# Altium schematic sheet DM3370_Connector_B.SchDoc: =project_title
size Tabloid; CompanyName: Luxonis Holding; Organization: Luxonis Holding; Address1: 1925 Harmony Park Drive; Address2: Westminster, CO; Address3: 80234; Address4: United States; DocumentNumber: 5; SheetNumber: 5; SheetTotal: 17
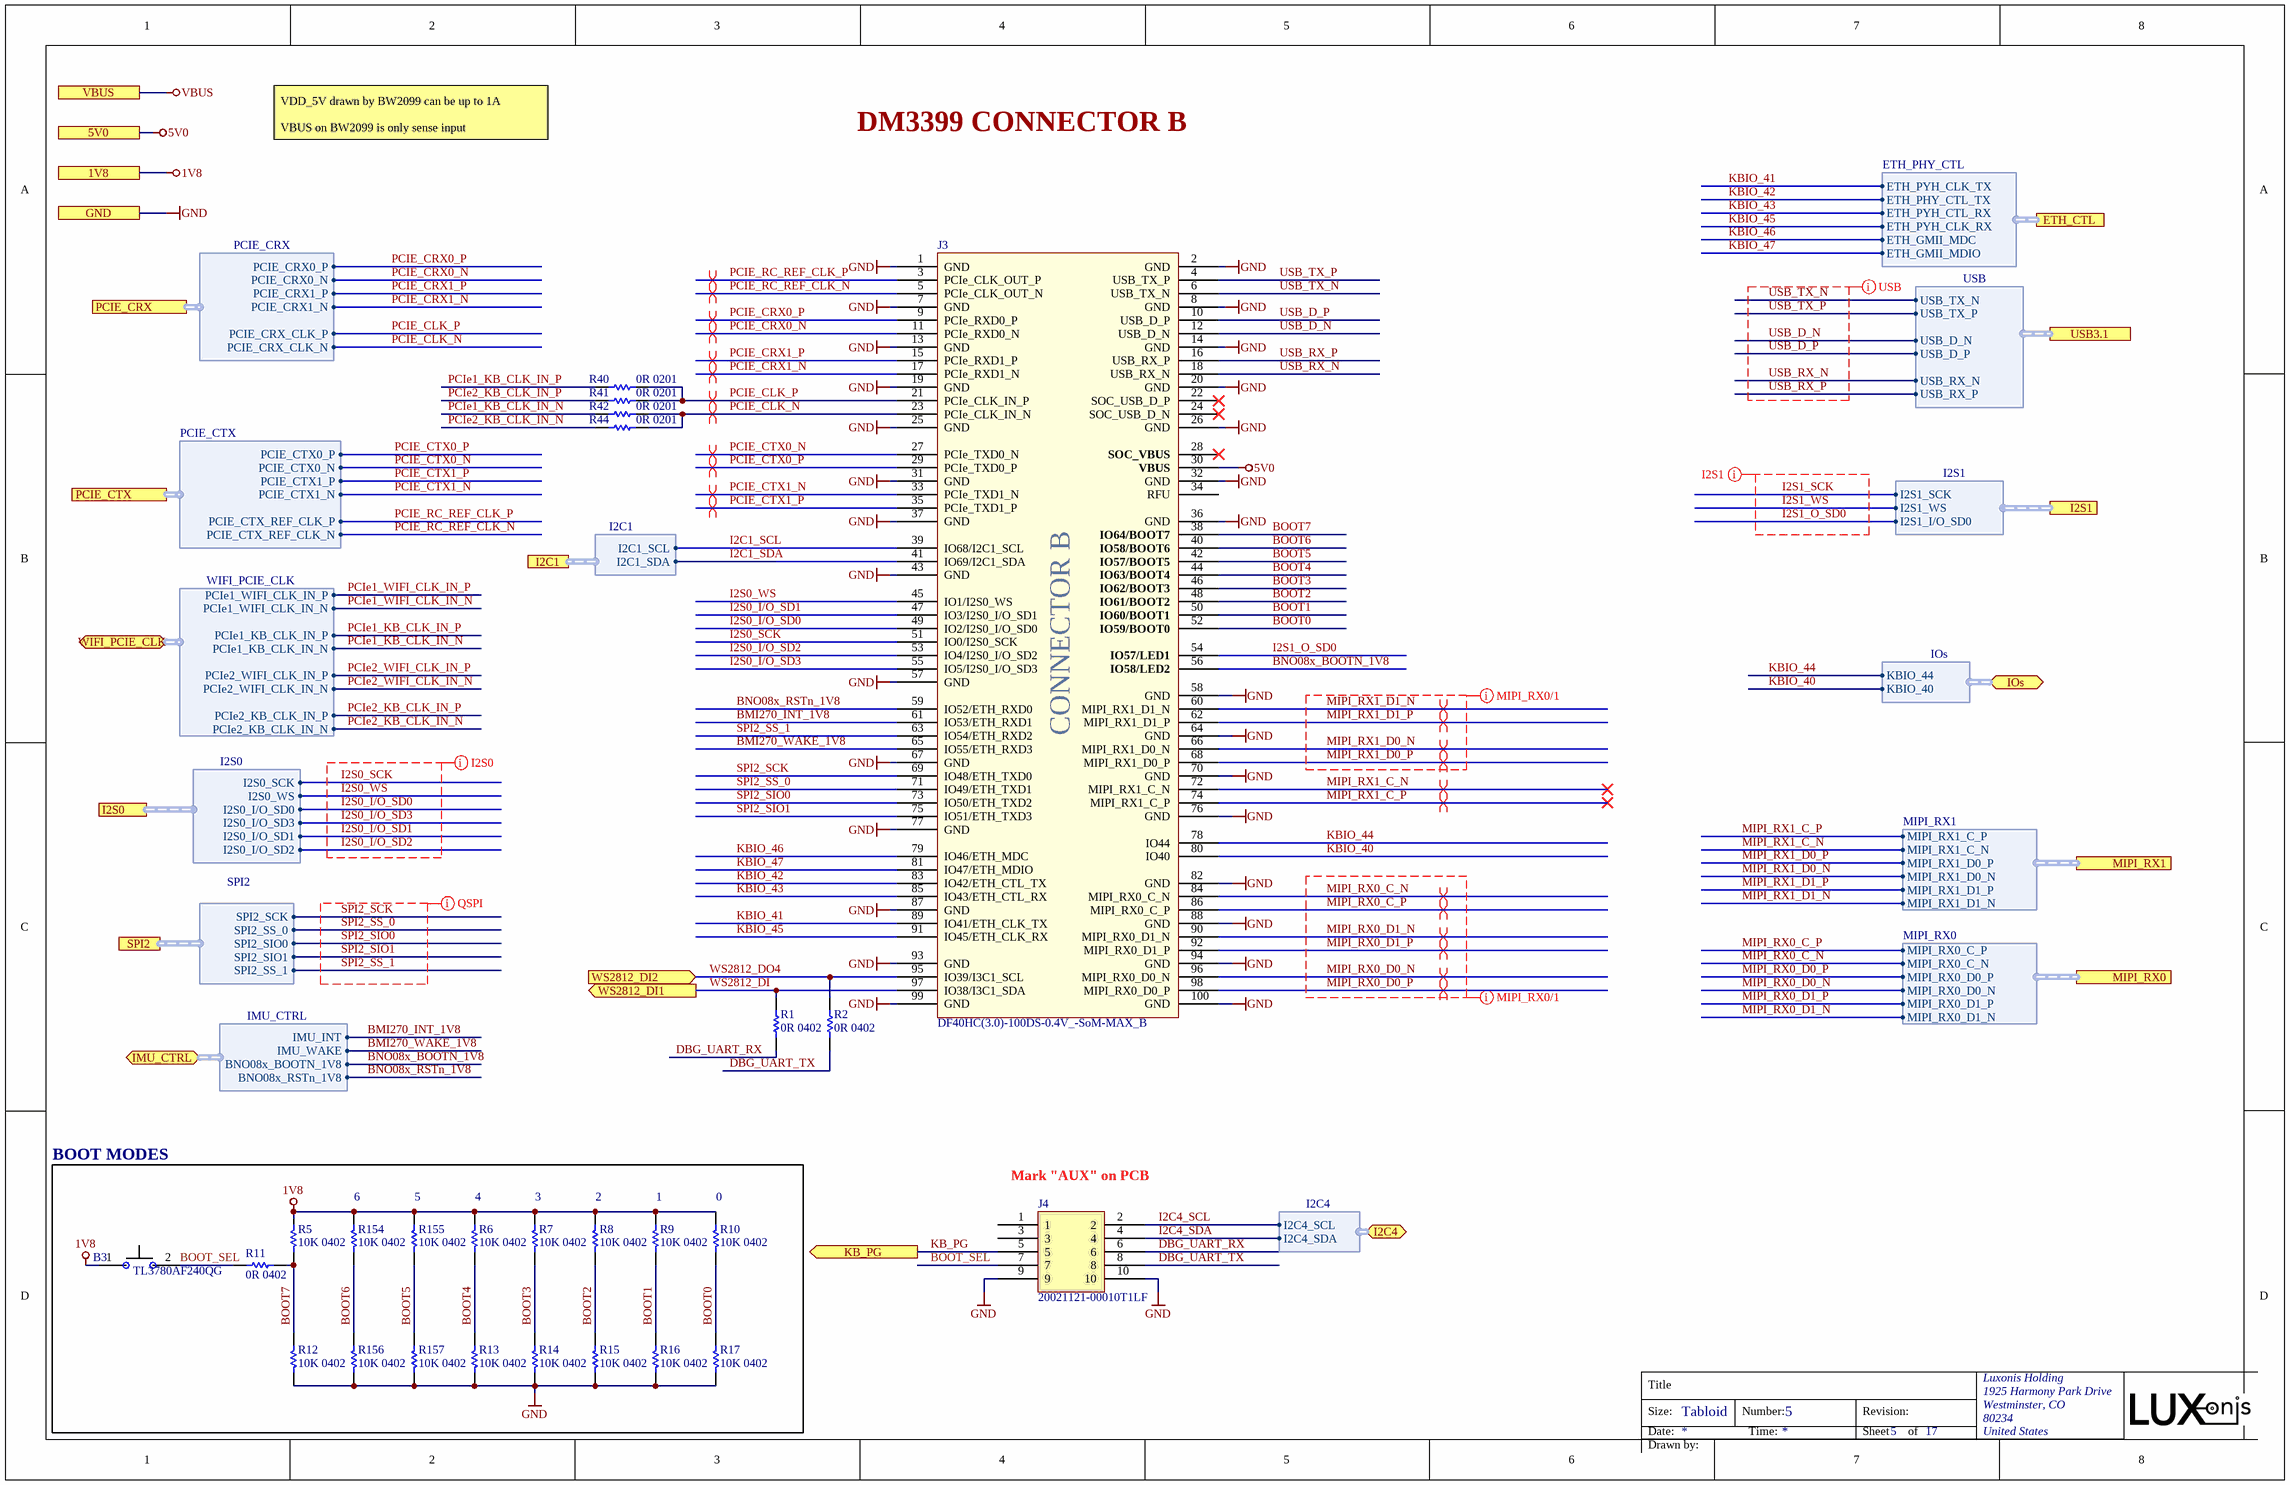
[diagram p0: DM3370_Connector_B.SchDoc]

## Parts
B3  TL3780AF240QG  [TL3780AF240QG-Footprint-1]
J3  DF40HC(3.0)-100DS-0.4V_-SoM-MAX_B  [SOM_MAX_CONN_B_DF40HC-3.0-100DS-0.4V_minpad]
J4  20021121-00010T1LF  [20021121-00010T1LF]
R1  0R 0402  [RESC0402(1005)_L]
R2  0R 0402  [RESC0402(1005)_L]
R5  10K 0402  [RESC0402(1005)_L]
R6  10K 0402  [RESC0402(1005)_L]
R7  10K 0402  [RESC0402(1005)_L]
R8  10K 0402  [RESC0402(1005)_L]
R9  10K 0402  [RESC0402(1005)_L]
R10  10K 0402  [RESC0402(1005)_L]
R11  0R 0402  [RESC0402(1005)_L]
R12  10K 0402  [RESC0402(1005)_L]
R13  10K 0402  [RESC0402(1005)_L]
R14  10K 0402  [RESC0402(1005)_L]
R15  10K 0402  [RESC0402(1005)_L]
R16  10K 0402  [RESC0402(1005)_L]
R17  10K 0402  [RESC0402(1005)_L]
R40  0R 0201  [RESC0201(0603)_L]
R41  0R 0201  [RESC0201(0603)_L]
R42  0R 0201  [RESC0201(0603)_L]
R44  0R 0201  [RESC0201(0603)_L]
R154  10K 0402  [RESC0402(1005)_L]
R155  10K 0402  [RESC0402(1005)_L]
R156  10K 0402  [RESC0402(1005)_L]
R157  10K 0402  [RESC0402(1005)_L]

## Blocks framed on the sheet
BOOT MODES: B3 R5-R17 R154-R157

## Ports
1V8, 5V0, ETH_CTL (harness ETH_PHY_CTL), GND, I2C1 (harness I2C1), I2C4 (bidir, harness I2C4), I2S0 (harness I2S0), I2S1 (harness I2S1), IMU_CTRL (bidir, harness IMU_CTRL), IOs (bidir, harness IOs), KB_PG (out), MIPI_RX0 (harness MIPI_RX0), MIPI_RX1 (harness MIPI_RX1), PCIE_CRX (harness PCIE_CRX), PCIE_CTX (harness PCIE_CTX), SPI2 (harness SPI2), USB3.1 (harness USB), VBUS, WIFI_PCIE_CLK (bidir, harness WIFI_PCIE_CLK), WS2812_DI1 (out), WS2812_DI2 (in)

## Harnesses
I2C4: I2C4_SCL, I2C4_SDA
I2S0: I2S0_SCK, I2S0_WS, I2S0_I/O_SD0, I2S0_I/O_SD1, I2S0_I/O_SD2, I2S0_I/O_SD3
USB: USB_D_P, USB_D_N, USB_TX_N, USB_TX_P, USB_RX_N, USB_RX_P
PCIE_CRX: PCIE_CRX0_P, PCIE_CRX0_N, PCIE_CRX1_P, PCIE_CRX1_N, PCIE_CRX_CLK_P, PCIE_CRX_CLK_N
PCIE_CTX: PCIE_CTX0_P, PCIE_CTX0_N, PCIE_CTX1_P, PCIE_CTX1_N, PCIE_CTX_REF_CLK_P, PCIE_CTX_REF_CLK_N
ETH_PHY_CTL: ETH_PYH_CLK_TX, ETH_PHY_CTL_TX, ETH_PYH_CTL_RX, ETH_PYH_CLK_RX, ETH_GMII_MDC, ETH_GMII_MDIO
MIPI_RX0: MIPI_RX0_C_P, MIPI_RX0_C_N, MIPI_RX0_D0_P, MIPI_RX0_D0_N, MIPI_RX0_D1_P, MIPI_RX0_D1_N
MIPI_RX1: MIPI_RX1_C_P, MIPI_RX1_C_N, MIPI_RX1_D0_P, MIPI_RX1_D0_N, MIPI_RX1_D1_P, MIPI_RX1_D1_N
I2C1: I2C1_SDA, I2C1_SCL
SPI2: SPI2_SCK, SPI2_SS_0, SPI2_SIO0, SPI2_SIO1, SPI2_SS_1
WIFI_PCIE_CLK: PCIe1_WIFI_CLK_IN_P, PCIe1_WIFI_CLK_IN_N, PCIe1_KB_CLK_IN_P, PCIe1_KB_CLK_IN_N, PCIe2_WIFI_CLK_IN_P, PCIe2_WIFI_CLK_IN_N, PCIe2_KB_CLK_IN_P, PCIe2_KB_CLK_IN_N
IOs: KBIO_44, KBIO_40
I2S1: I2S1_SCK, I2S1_WS, I2S1_I/O_SD0
IMU_CTRL: IMU_INT, IMU_WAKE, BNO08x_BOOTN_1V8, BNO08x_RSTn_1V8

## Nets
1V8: B3.1 R5.1 R6.1 R7.1 R8.1 R9.1 R10.1 R154.1 R155.1 ; port 1V8
5V0: J3.30(VBUS) ; port 5V0
GND: J3.1(GND) J3.2(GND) J3.7(GND) J3.8(GND) J3.13(GND) J3.14(GND) J3.19(GND) J3.20(GND) J3.25(GND) J3.26(GND) J3.31(GND) J3.32(GND) J3.36(GND) J3.37(GND) J3.43(GND) J3.57(GND) J3.58(GND) J3.64(GND) J3.67(GND) J3.70(GND) J3.76(GND) J3.77(GND) J3.82(GND) J3.87(GND) J3.88(GND) J3.93(GND) J3.94(GND) J3.99(GND) J3.100(GND) J4.9 J4.10 R12.2 R13.2 R14.2 R15.2 R16.2 R17.2 R156.2 R157.2 ; port GND
VBUS: port VBUS
BMI270_INT_1V8: J3.61(IO53/ETH_RXD1) ; port IMU_CTRL.IMU_INT
BMI270_WAKE_1V8: J3.65(IO55/ETH_RXD3) ; port IMU_CTRL.IMU_WAKE
BNO08x_BOOTN_1V8: J3.56(IO58/LED2) ; port IMU_CTRL.BNO08x_BOOTN_1V8
BNO08x_RSTn_1V8: J3.59(IO52/ETH_RXD0) ; port IMU_CTRL.BNO08x_RSTn_1V8
BOOT0: J3.52(IO59/BOOT0) R10.2 R17.1
BOOT1: J3.50(IO60/BOOT1) R9.2 R16.1
BOOT2: J3.48(IO61/BOOT2) R8.2 R15.1
BOOT3: J3.46(IO62/BOOT3) R7.2 R14.1
BOOT4: J3.44(IO63/BOOT4) R6.2 R13.1
BOOT5: J3.42(IO57/BOOT5) R155.2 R157.1
BOOT6: J3.40(IO58/BOOT6) R154.2 R156.1
BOOT7: J3.38(IO64/BOOT7) R5.2 R11.2 R12.1
BOOT_SEL: B3.2 J4.7 R11.1
DBG_UART_RX: J4.6 R1.1
DBG_UART_TX: J4.8 R2.1
I2C1_SCL: J3.39(IO68/I2C1_SCL) ; port I2C1.I2C1_SCL
I2C1_SDA: J3.41(IO69/I2C1_SDA) ; port I2C1.I2C1_SDA
I2C4_SCL: J4.2 ; port I2C4.I2C4_SCL
I2C4_SDA: J4.4 ; port I2C4.I2C4_SDA
I2S0_I/O_SD0: J3.49(IO2/I2S0_I/O_SD0) ; port I2S0.I2S0_I/O_SD0
I2S0_I/O_SD1: J3.47(IO3/I2S0_I/O_SD1) ; port I2S0.I2S0_I/O_SD1
I2S0_I/O_SD2: J3.53(IO4/I2S0_I/O_SD2) ; port I2S0.I2S0_I/O_SD2
I2S0_I/O_SD3: J3.55(IO5/I2S0_I/O_SD3) ; port I2S0.I2S0_I/O_SD3
I2S0_SCK: J3.51(IO0/I2S0_SCK) ; port I2S0.I2S0_SCK
I2S0_WS: J3.45(IO1/I2S0_WS) ; port I2S0.I2S0_WS
I2S1_O_SD0: J3.54(IO57/LED1) ; port I2S1.I2S1_I/O_SD0
I2S1_SCK: port I2S1.I2S1_SCK
I2S1_WS: port I2S1.I2S1_WS
KB_PG: J4.5 ; port KB_PG
KBIO_40: J3.80(IO40) ; port IOs.KBIO_40
KBIO_41: J3.89(IO41/ETH_CLK_TX) ; port ETH_CTL.ETH_PYH_CLK_TX
KBIO_42: J3.83(IO42/ETH_CTL_TX) ; port ETH_CTL.ETH_PHY_CTL_TX
KBIO_43: J3.85(IO43/ETH_CTL_RX) ; port ETH_CTL.ETH_PYH_CTL_RX
KBIO_44: J3.78(IO44) ; port IOs.KBIO_44
KBIO_45: J3.91(IO45/ETH_CLK_RX) ; port ETH_CTL.ETH_PYH_CLK_RX
KBIO_46: J3.79(IO46/ETH_MDC) ; port ETH_CTL.ETH_GMII_MDC
KBIO_47: J3.81(IO47/ETH_MDIO) ; port ETH_CTL.ETH_GMII_MDIO
MIPI_RX0_C_N: J3.84(MIPI_RX0_C_N) ; port MIPI_RX0.MIPI_RX0_C_N
MIPI_RX0_C_P: J3.86(MIPI_RX0_C_P) ; port MIPI_RX0.MIPI_RX0_C_P
MIPI_RX0_D0_N: J3.96(MIPI_RX0_D0_N) ; port MIPI_RX0.MIPI_RX0_D0_N
MIPI_RX0_D0_P: J3.98(MIPI_RX0_D0_P) ; port MIPI_RX0.MIPI_RX0_D0_P
MIPI_RX0_D1_N: J3.90(MIPI_RX0_D1_N) ; port MIPI_RX0.MIPI_RX0_D1_N
MIPI_RX0_D1_P: J3.92(MIPI_RX0_D1_P) ; port MIPI_RX0.MIPI_RX0_D1_P
MIPI_RX1_C_N: J3.72(MIPI_RX1_C_N) ; port MIPI_RX1.MIPI_RX1_C_N
MIPI_RX1_C_P: J3.74(MIPI_RX1_C_P) ; port MIPI_RX1.MIPI_RX1_C_P
MIPI_RX1_D0_N: J3.66(MIPI_RX1_D0_N) ; port MIPI_RX1.MIPI_RX1_D0_N
MIPI_RX1_D0_P: J3.68(MIPI_RX1_D0_P) ; port MIPI_RX1.MIPI_RX1_D0_P
MIPI_RX1_D1_N: J3.60(MIPI_RX1_D1_N) ; port MIPI_RX1.MIPI_RX1_D1_N
MIPI_RX1_D1_P: J3.62(MIPI_RX1_D1_P) ; port MIPI_RX1.MIPI_RX1_D1_P
PCIe1_KB_CLK_IN_N: R42.1 ; port WIFI_PCIE_CLK.PCIe1_KB_CLK_IN_N
PCIe1_KB_CLK_IN_P: R40.1 ; port WIFI_PCIE_CLK.PCIe1_KB_CLK_IN_P
PCIe1_WIFI_CLK_IN_N: port WIFI_PCIE_CLK.PCIe1_WIFI_CLK_IN_N
PCIe1_WIFI_CLK_IN_P: port WIFI_PCIE_CLK.PCIe1_WIFI_CLK_IN_P
PCIe2_KB_CLK_IN_N: R44.1 ; port WIFI_PCIE_CLK.PCIe2_KB_CLK_IN_N
PCIe2_KB_CLK_IN_P: R41.1 ; port WIFI_PCIE_CLK.PCIe2_KB_CLK_IN_P
PCIe2_WIFI_CLK_IN_N: port WIFI_PCIE_CLK.PCIe2_WIFI_CLK_IN_N
PCIe2_WIFI_CLK_IN_P: port WIFI_PCIE_CLK.PCIe2_WIFI_CLK_IN_P
PCIE_CLK_N: J3.23(PCIe_CLK_IN_N) R42.2 R44.2 ; port PCIE_CRX.PCIE_CRX_CLK_N
PCIE_CLK_P: J3.21(PCIe_CLK_IN_P) R40.2 R41.2 ; port PCIE_CRX.PCIE_CRX_CLK_P
PCIE_CRX0_N: J3.11(PCIe_RXD0_N) ; port PCIE_CRX.PCIE_CRX0_N
PCIE_CRX0_P: J3.9(PCIe_RXD0_P) ; port PCIE_CRX.PCIE_CRX0_P
PCIE_CRX1_N: J3.17(PCIe_RXD1_N) ; port PCIE_CRX.PCIE_CRX1_N
PCIE_CRX1_P: J3.15(PCIe_RXD1_P) ; port PCIE_CRX.PCIE_CRX1_P
PCIE_CTX0_N: J3.27(PCIe_TXD0_N) ; port PCIE_CTX.PCIE_CTX0_N
PCIE_CTX0_P: J3.29(PCIe_TXD0_P) ; port PCIE_CTX.PCIE_CTX0_P
PCIE_CTX1_N: J3.33(PCIe_TXD1_N) ; port PCIE_CTX.PCIE_CTX1_N
PCIE_CTX1_P: J3.35(PCIe_TXD1_P) ; port PCIE_CTX.PCIE_CTX1_P
PCIE_RC_REF_CLK_N: J3.5(PCIe_CLK_OUT_N) ; port PCIE_CTX.PCIE_CTX_REF_CLK_N
PCIE_RC_REF_CLK_P: J3.3(PCIe_CLK_OUT_P) ; port PCIE_CTX.PCIE_CTX_REF_CLK_P
SPI2_SCK: J3.69(IO48/ETH_TXD0) ; port SPI2.SPI2_SCK
SPI2_SIO0: J3.73(IO50/ETH_TXD2) ; port SPI2.SPI2_SIO0
SPI2_SIO1: J3.75(IO51/ETH_TXD3) ; port SPI2.SPI2_SIO1
SPI2_SS_0: J3.71(IO49/ETH_TXD1) ; port SPI2.SPI2_SS_0
SPI2_SS_1: J3.63(IO54/ETH_RXD2) ; port SPI2.SPI2_SS_1
USB_D_N: J3.12(USB_D_N) ; port USB3.1.USB_D_N
USB_D_P: J3.10(USB_D_P) ; port USB3.1.USB_D_P
USB_RX_N: J3.18(USB_RX_N) ; port USB3.1.USB_RX_N
USB_RX_P: J3.16(USB_RX_P) ; port USB3.1.USB_RX_P
USB_TX_N: J3.6(USB_TX_N) ; port USB3.1.USB_TX_N
USB_TX_P: J3.4(USB_TX_P) ; port USB3.1.USB_TX_P
WS2812_DI: J3.97(IO38/I3C1_SDA) R1.2 ; port WS2812_DI1
WS2812_DO4: J3.95(IO39/I3C1_SCL) R2.2 ; port WS2812_DI2

Not connected (* = marked no-connect by the designer): J3 22(SOC_USB_D_P)* 24(SOC_USB_D_N)* 28(SOC_VBUS)* 34(RFU); J4 1 3

## Layout directives
net class USB: USB_D_N, USB_D_P, USB_RX_N, USB_RX_P, USB_TX_N, USB_TX_P
net class I2S1: I2S0_I/O_SD0, I2S0_I/O_SD1, I2S0_I/O_SD2, I2S0_I/O_SD3, I2S0_SCK, I2S0_WS, I2S1_O_SD0, I2S1_SCK, I2S1_WS
differential pair; differential pair class 100ohm: MIPI_RX0_C_N, MIPI_RX0_C_P, MIPI_RX0_D0_N, MIPI_RX0_D0_P, MIPI_RX0_D1_N, MIPI_RX0_D1_P, MIPI_RX1_C_N, MIPI_RX1_C_P, MIPI_RX1_D0_N, MIPI_RX1_D0_P, MIPI_RX1_D1_N, MIPI_RX1_D1_P
net class MIPI_RX0/1: MIPI_RX0_C_N, MIPI_RX0_C_P, MIPI_RX0_D0_N, MIPI_RX0_D0_P, MIPI_RX0_D1_N, MIPI_RX0_D1_P, MIPI_RX1_D0_N, MIPI_RX1_D0_P, MIPI_RX1_D1_N, MIPI_RX1_D1_P
net class QSPI: SPI2_SCK, SPI2_SIO0, SPI2_SIO1, SPI2_SS_0, SPI2_SS_1
differential pair; differential pair class 100ohm; net class PCIE: PCIE_CLK_N, PCIE_CLK_P, PCIE_CRX0_N, PCIE_CRX0_P, PCIE_CRX1_N, PCIE_CRX1_P, PCIE_CTX0_N, PCIE_CTX0_P, PCIE_CTX1_N, PCIE_CTX1_P, PCIE_RC_REF_CLK_N, PCIE_RC_REF_CLK_P

## Notes on the sheet
- VDD_5V drawn by BW2099 can be up to 1A
  VBUS on BW2099 is only sense input
- DM3399 CONNECTOR B
- (near R154) 6
- (near R155) 5
- (near R6) 4
- (near R7) 3
- (near R8) 2
- (near R9) 1
- (near R10) 0
- (near J4) Mark "AUX" on PCB
- Title
- Size:
- Date:
- Tabloid
- Number:
- Time:
- Revision:
- Sheet
- of
- Drawn by:
- (in symbol CMP-040-000001-3) CONNECTOR B

## Library data of the parts
B3 = CMP-011-00023-1: Keypad Switch, 1 Switches, SPST, Momentary-tactile, 0.05A, 12VDC, 2.35N, Solder Terminal, Surface Mount-straight; Manufacturer 1: E-Switch; Manufacturer Part Number 1: TL3780AF240QG
J3 = CMP-040-000001-3: OAK-SoM-MAX base board conn. B; Manufacturer 1: Hirose; Manufacturer Part Number 1: DF40HC(3.0)-100DS-0.4V(58); System: Connector; Connector Type: Receptacle; Pitch: 0.016inch; Number of Positions: 100; ComponentLink1Description: https://datasheet.ciiva.com/46636/ed-df40-20140305-46636517.pdf?src-supplier=Digi-Key; ComponentLink2Description: https://datasheet.ciiva.com/18562/ed-df40-20140305-18562189.pdf?src-supplier=Digi-Key; Source: LuxonisMaster_nejc.SchLib; RoHS: Yes; ComponentLink2URL: https://datasheet.ciiva.com/18562/ed-df40-20140305-18562189.pdf?src-supplier=Digi-Key; Mount: Surface Mount; Packaging: Tape and Reel; ComponentLink3URL: https://datasheet.ciiva.com/13559/ed-df40-20140305-13559540.pdf?src-supplier=Mouser; Pricing 2: 1=2.50000, 10=2.40000, 25=2.10000, 50=2.10000, 100=2.00000, 250=1.76000, 500=1.71000, 1000=1.45000, 2000=1.36000, 5000=1.31000, 10000=1.31000 (USD); Package Quantity: 1000; Stock 2: 2078; Lead Free: Lead Free; ComponentLink4Description: https://datasheet.ciiva.com/18562/ed-df40-20140305-18562462.pdf?src-supplier=Digi-Key; Pricing 1: 1=2.54000, 10=2.26000, 25=2.07000, 50=2.07000, 100=1.98000, 250=1.79000, 500=1.65000, 1000=1.41000, 3000=1.32000, 6000=1.23000, 10000=1.23000 (USD); Design Item ID: DF40HC(3.0)-100DS-0.4V_-SoM-MAX_B; ComponentLink1URL: https://datasheet.ciiva.com/46636/ed-df40-20140305-46636517.pdf?src-supplier=Digi-Key; ComponentLink3Description: https://datasheet.ciiva.com/13559/ed-df40-20140305-13559540.pdf?src-supplier=Mouser; Contact Plating: Gold; ComponentLink4URL: https://datasheet.ciiva.com/18562/ed-df40-20140305-18562462.pdf?src-supplier=Digi-Key; Stock 1: 2172; Number of Rows: 2
J4 = 20021121-00010T1LF: CONN HEADER SMD 10POS 1.27MM; Manufacturer 1: Amphenol FCI; Number of Contacts: 10; Contact Resistance: 30mR; Max Voltage Rating (AC): 125V; Connector Type: Male Pin; Row Spacing: 0.05inch; Supplier 1: Digi-Key; Manufacturer Part Number 1: 20021121-00010T1LF; Stock 1: 1465; Pricing 1: 1=0.77000, 10=0.71800, 100=0.55040, 500=0.47860, 1000=0.39485, 5000=0.34699, 10000=0.32306 (USD); RoHS: Yes; Mount: Surface Mount; Contact Plating: Gold; Color: Black; Contact Material: Copper Alloy; Housing Color: Black; Housing Material: Thermoplastic; Min Operating Temperature: -40°C; Max Operating Temperature: 85°C; Number of Rows: 2; Termination: Solder; Package Quantity: 93; Packaging: Rail/Tube; Number of Positions: 10; Orientation: Straight; Length: 6.35mm; Pitch: 1.27mm; Contact Mating Length: 0.12inch; Depth: 3.4mm; ComponentLink1URL: https://datasheet.ciiva.com/18659/20021121-18659066.pdf?src-supplier=Digi-Key; ComponentLink1Description: https://datasheet.ciiva.com/18659/20021121-18659066.pdf?src-supplier=Digi-Key; ComponentLink2URL: https://datasheet.ciiva.com/10033/20021121-10033582.pdf?src-supplier=Avnet; ComponentLink2Description: https://datasheet.ciiva.com/10033/20021121-10033582.pdf?src-supplier=Avnet; Supplier Part Number 1: 609-6529-ND; Supplier 2: Mouser; Supplier 3: TTI; Supplier Part Number 2: 649-200211210010T1LF; Supplier Part Number 3: 20021121-00010T1LF
R1 R2 R11 = CRCW04020000Z0ED: RES SMD 0 OHM JUMPER 1/16W 0402; Manufacturer 1: Vishay; Resistance: 0mR; Power Rating: 63mW; Voltage Rating: 50V; Temperature Coefficient: 100ppm/°C; Tolerance: 5%; Supplier 1: Digi-Key; Manufacturer Part Number 1: CRCW04020000Z0ED; Stock 1: 855968; Pricing 1: 1=0.10000, 10=0.03400, 25=0.02440, 50=0.01860, 100=0.01380, 250=0.01048, 500=0.00840, 1000=0.00618, 5000=0.00443 (USD); RoHS: Yes; Mount: Surface Mount; Case/Package: 0402; Weight: 2.3E-05oz; Case Code (Imperial): 0402; Case Code (Metric): 1005; Contact Plating: Tin; Min Operating Temperature: -55°C; Max Operating Temperature: 155°C; Packaging: Tape and Reel; Composition: Thick Film; Voltage Rating (DC): 50V; Package Quantity: 1; Termination: SMD/SMT; Number of Terminations: 2; Military Standard: Not; Max Power Dissipation: 63mW; Features: Automotive AEC-Q200; Length: 1mm; Height: 0.35mm; Width: 0.5mm; Depth: 0.5mm; Radiation Hardening: No; REACH SVHC: Unknown; Lead Free: Lead Free; ComponentLink1URL: https://datasheet.ciiva.com/3255/dcrcwe3-3255944.pdf?src-supplier=Avnet; ComponentLink1Description: https://datasheet.ciiva.com/3255/dcrcwe3-3255944.pdf?src-supplier=Avnet; ComponentLink2URL: https://datasheet.ciiva.com/3255/dcrcwe3-3255945.pdf?src-supplier=Avnet; ComponentLink2Description: https://datasheet.ciiva.com/3255/dcrcwe3-3255945.pdf?src-supplier=Avnet; ComponentLink3URL: https://datasheet.ciiva.com/16881/dcrcwe3-16881413.pdf?src-supplier=Avnet+Europe; ComponentLink3Description: https://datasheet.ciiva.com/16881/dcrcwe3-16881413.pdf?src-supplier=Avnet+Europe; ComponentLink4URL: https://datasheet.ciiva.com/2461/dcrcwe3-2461962.pdf?src-supplier=Digi-Key; ComponentLink4Description: https://datasheet.ciiva.com/2461/dcrcwe3-2461962.pdf?src-supplier=Digi-Key; ComponentLink5URL: https://datasheet.ciiva.com/7841/1720486-7841802.pdf?src-supplier=Element14; ComponentLink5Description: https://datasheet.ciiva.com/7841/1720486-7841802.pdf?src-supplier=Element14; ComponentLink6URL: https://datasheet.ciiva.com/2461/dcrcwe3-2461963.pdf?src-supplier=Digi-Key; ComponentLink6Description: https://datasheet.ciiva.com/2461/dcrcwe3-2461963.pdf?src-supplier=Digi-Key; ComponentLink7URL: https://datasheet.ciiva.com/2461/dcrcwe3-2461964.pdf?src-supplier=Digi-Key; ComponentLink7Description: https://datasheet.ciiva.com/2461/dcrcwe3-2461964.pdf?src-supplier=Digi-Key; ComponentLink8URL: https://datasheet.ciiva.com/7841/1697337-7841468.pdf?src-supplier=Element14; ComponentLink8Description: https://datasheet.ciiva.com/7841/1697337-7841468.pdf?src-supplier=Element14; ComponentLink9URL: https://datasheet.ciiva.com/16761/70200976-16761309.pdf?src-supplier=Allied+Electronics; ComponentLink9Description: https://datasheet.ciiva.com/16761/70200976-16761309.pdf?src-supplier=Allied+Electronics; ComponentLink10URL: https://datasheet.ciiva.com/26311/fld-crcw-e3-data-en-26311550.pdf?src-supplier=Distrelec; ComponentLink10Description: https://datasheet.ciiva.com/26311/fld-crcw-e3-data-en-26311550.pdf?src-supplier=Distrelec; Supplier Part Number 1: 541-0.0JCT-ND
R5-R10 R12-R17 R154-R157 = RC0402FR-1310KL: RES SMD 10K OHM 1% 0402 1/16W Chip Resistor, 0402 [1005 Metric], 10 kohm, RC Series, 50 V, Thick Film, 62.5 mW; Manufacturer 1: Yageo; Resistance: 10kR; Temperature Coefficient: 100ppm/°C; Power Rating: 62.5mW; Voltage Rating: 50V; ComponentLink1URL: https://datasheet.ciiva.com/16940/pyu-rc0402-51-rohs-l-6-16940293.pdf?src-supplier=Avnet+Europe; ComponentLink1Description: https://datasheet.ciiva.com/16940/pyu-rc0402-51-rohs-l-6-16940293.pdf?src-supplier=Avnet+Europe; ComponentLink2URL: https://datasheet.ciiva.com/28386/pyu-rc0402-51-rohs-l-6-28386855.pdf?src-supplier=Avnet+Europe; ComponentLink2Description: https://datasheet.ciiva.com/28386/pyu-rc0402-51-rohs-l-6-28386855.pdf?src-supplier=Avnet+Europe; ComponentLink3URL: https://datasheet.ciiva.com/16740/pyu-rc0402-51-rohs-l-6-r-16740602.pdf?src-supplier=Future+Electronics; ComponentLink3Description: https://datasheet.ciiva.com/16740/pyu-rc0402-51-rohs-l-6-r-16740602.pdf?src-supplier=Future+Electronics; ComponentLink4URL: https://datasheet.ciiva.com/8891/pyu-rc0402-51-rohs-l-6-8891339.pdf?src-supplier=Avnet; ComponentLink4Description: https://datasheet.ciiva.com/8891/pyu-rc0402-51-rohs-l-6-8891339.pdf?src-supplier=Avnet; ComponentLink5URL: https://datasheet.ciiva.com/5557/pyu-rc0402-51-rohs-l-6-r-5557997.pdf?src-supplier=Mouser; ComponentLink5Description: https://datasheet.ciiva.com/5557/pyu-rc0402-51-rohs-l-6-r-5557997.pdf?src-supplier=Mouser; ComponentLink6URL: https://datasheet.ciiva.com/7983/1018594-7983533.pdf?src-supplier=Element14; ComponentLink6Description: https://datasheet.ciiva.com/7983/1018594-7983533.pdf?src-supplier=Element14; Supplier 1: Newark; Manufacturer Part Number 1: RC0402FR-1310KL; Stock 1: 62239; Pricing 1: 1=0.10000, 25=0.01200, 100=0.00400, 250=0.00400, 500=0.00300, 1000=0.00300 (USD); RoHS: Yes; Case/Package: 0402; Number of Pins: 2; Contact Plating: Tin,Matte,Lead; Case Code (Imperial): 0402; Case Code (Metric): 1005; Min Operating Temperature: -55°C; Max Operating Temperature: 155°C; Tolerance: 1%; Composition: Thick Film; Packaging: Tape and Reel; Termination: SMD/SMT; Military Standard: Not; Voltage Rating (DC): 50V; Working Voltage: 50V; Number of Terminations: 2; Length: 1mm; Depth: 0.5mm; Radiation Hardening: No; REACH SVHC: No SVHC; Lead Free: Lead Free; Supplier Part Number 1: 67R9960
R40-R42 R44 = CRCW02010000Z0ED: RES SMD 0 OHM JUMPER 1/16W 0201; Manufacturer 1: Vishay; Rated Power Dissipation (P): 50mW; Rated Temperature: 70°C; Package Height: 0.23mm; Package Length: 0.6mm; Package Width: 0.3mm; Reference Standard: AEC-Q200; Supplier 1: Newark; Manufacturer Part Number 1: CRCW02010000Z0ED; RoHS: Yes; Category: Chip SMD Resistors; Stock 1: 200000; Pricing 1: 1=0,03600, 10000=0,03600, 30000=0,03400 (USD); Mount: Surface Mount; Number of Pins: 2; Package Shape: Rectangular; Size Code: 0201; Terminal Finish: Nickel; Min Operating Temperature: -55°C; Max Operating Temperature: 155°C; JESD-609 Code: e3; Resistor Type: FIXED RESISTOR; Construction: Chip; Package Style: SMTMeter; Packaging: Tape and Reel; Resistance: 0R; Technology: METAL GLAZE/THICK FILM; Termination: Wraparound; REACH SVHC: Yes; RoHS Compliant: Yes; ComponentLink1URL: https://datasheet.ciiva.com:443/pdfs/VipMasterIC/IC/VISH/VISH-S-A0002932828/VISH-S-A0002932828-1.pdf?src-supplier=IHS+Markit; ComponentLink1Description: https://datasheet.ciiva.com:443/pdfs/VipMasterIC/IC/VISH/VISH-S-A0002932828/VISH-S-A0002932828-1.pdf?src-supplier=IHS+Markit; ComponentLink2URL: https://datasheet.ciiva.com/2471/crcw0201e3-2471712.pdf?src-supplier=Digi-Key; ComponentLink2Description: https://datasheet.ciiva.com/2471/crcw0201e3-2471712.pdf?src-supplier=Digi-Key; ComponentLink3URL: https://datasheet.ciiva.com/2471/crcw0201e3-2471713.pdf?src-supplier=Digi-Key; ComponentLink3Description: https://datasheet.ciiva.com/2471/crcw0201e3-2471713.pdf?src-supplier=Digi-Key; ComponentLink4URL: https://datasheet.ciiva.com/7841/1719906-7841431.pdf?src-supplier=Element14; ComponentLink4Description: https://datasheet.ciiva.com/7841/1719906-7841431.pdf?src-supplier=Element14; ComponentLink5URL: https://datasheet.ciiva.com/22665/1847332-22665688.pdf?src-supplier=Element14; ComponentLink5Description: https://datasheet.ciiva.com/22665/1847332-22665688.pdf?src-supplier=Element14; ComponentLink6URL: https://datasheet.ciiva.com/2471/crcw0201e3-2471711.pdf?src-supplier=Digi-Key; ComponentLink6Description: https://datasheet.ciiva.com/2471/crcw0201e3-2471711.pdf?src-supplier=Digi-Key; ComponentLink7URL: https://datasheet.ciiva.com/7841/1719906-7841430.pdf?src-supplier=Element14; ComponentLink7Description: https://datasheet.ciiva.com/7841/1719906-7841430.pdf?src-supplier=Element14; ComponentLink8URL: https://datasheet.ciiva.com/16757/70202042-16757849.pdf?src-supplier=Allied+Electronics; ComponentLink8Description: https://datasheet.ciiva.com/16757/70202042-16757849.pdf?src-supplier=Allied+Electronics; ComponentLink9URL: https://datasheet.ciiva.com/16436/crcw0201e3-16436237.pdf?src-supplier=Future+Electronics; ComponentLink9Description: https://datasheet.ciiva.com/16436/crcw0201e3-16436237.pdf?src-supplier=Future+Electronics; Supplier Part Number 1: 24W1433